# EAGLE design stknx_breakout (EAGLE 9.6.0)
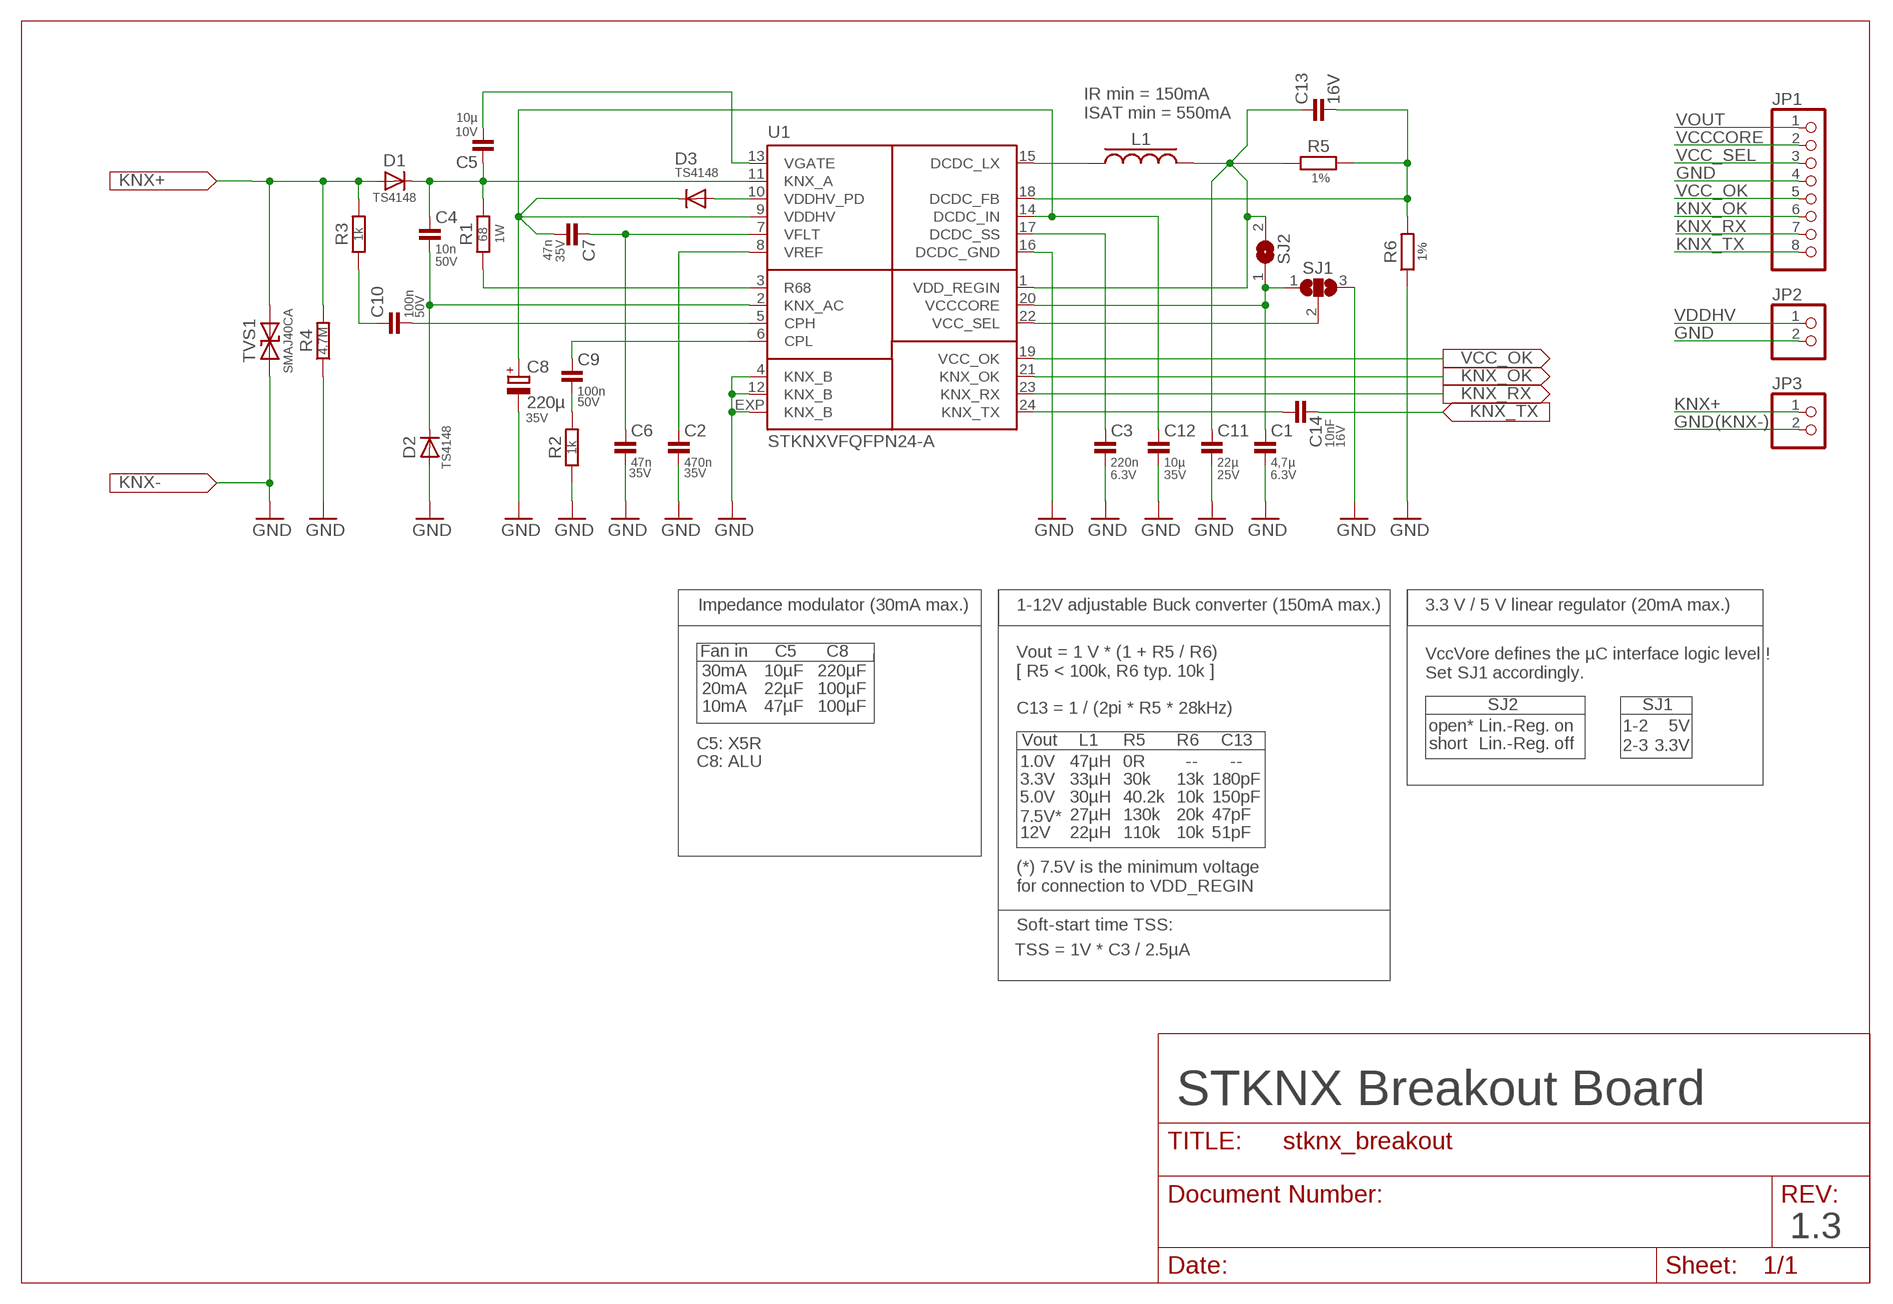
[diagram p0: schematic, sheet 1]

## Parts
C1  4,7µ  C-EUC0805  [C0805]
C2  470n  C-EUC0805  [C0805]
C3  220n  C-EUC0805  [C0805]
C4  10n  C-EUC0805  [C0805]
C5  10µ  C-EUC0805  [C0805]
C6  47n  C-EUC0805  [C0805]
C7  47n  C-EUC0805  [C0805]
C8  220µ  CPOL-EUF  [PANASONIC_F]
C9  100n  C-EUC0805  [C0805]
C10  100n  C-EUC0805  [C0805]
C11  22µ  C-EUC0805  [C0805]
C12  10µ  C-EUC0805  [C0805]
C13  C13  C-EUC0805  [C0805]
C14  10nF  C-EUC0805  [C0805]
D1  TS4148  [0805]
D2  TS4148  [0805]
D3  TS4148  [0805]
JP1  PINHD-1X8  [1X08]
JP2  PINHD-1X2  [1X02]
JP3  PINHD-1X2  [1X02]
L1  L1  WE-LQS_4025_74404043220A  [WE-LQS_4025]
R1  68  R-EU_R1218  [R1218]
R2  1k  R-EU_R0805  [R0805]
R3  1k  R-EU_R0805  [R0805]
R4  4.7M  R-EU_R0805  [R0805]
R5  R5  R-EU_R0805  [R0805]
R6  R6  R-EU_R0805  [R0805]
SJ1  SJ2WW  [SJ_2W]
SJ2  SJW  [SJW]
TVS1  SMAJ40CA  [DO-214AC(SMA)]
U1  STKNXVFQFPN24-A  [VFQFPN24-A]

## Nets
DCDC_FB: C13.2 R5.2 R6.2 U1.18(DCDC_FB)
DCDC_SS: C3.1 U1.17(DCDC_SS)
GND: C1.2 C2.2 C3.2 C6.2 C8.- C11.2 C12.2 D2.A JP1.4 JP2.2 JP3.2 R2.1 R4.1 R6.1 SJ1.3 TVS1.2(A2) U1.4(KNX_B) U1.12(KNX_B) U1.16(DCDC_GND) U1.EXP(KNX_B)
KNX+: D1.A JP3.1 R3.2 R4.2 TVS1.1(A1)
KNX_OK: JP1.6 U1.21(KNX_OK)
KNX_RX: JP1.7 U1.23(KNX_RX)
KNX_TX: C14.2 JP1.8
KNX_TX_1: C14.1 U1.24(KNX_TX)
N$1: C2.1 U1.8(VREF)
N$3: C6.1 C7.1 U1.7(VFLT)
N$4: R1.1 U1.3(R68)
N$6: C4.2 D2.C U1.2(KNX_AC)
N$7: C4.1 C5.1 D1.C R1.2 U1.11(KNX_A)
N$9: D3.A U1.10(VDDHV_PD)
N$10: C9.2 R2.2
N$11: C9.1 U1.6(CPL)
N$12: C10.1 R3.1
N$14: C10.2 U1.5(CPH)
N$15: L1.1 U1.15(DCDC_LX)
VCC_OK: JP1.5 U1.19(VCC_OK)
VCC_SEL: JP1.3 SJ1.2 U1.22(VCC_SEL)
VCCCORE: C1.1 JP1.2 SJ1.1 SJ2.1 U1.20(VCCCORE)
VDDHV: C7.2 C8.+ C12.1 D3.C JP2.1 U1.9(VDDHV) U1.14(DCDC_IN)
VGATE: C5.2 U1.13(VGATE)
VOUT: C11.1 C13.1 JP1.1 L1.2 R5.1 SJ2.2 U1.1(VDD_REGIN)

## Notes on the sheet
- IR min = 150mA
  ISAT min = 550mA
- 1W
- (KNX-)
- Impedance modulator (30mA max.) | 1-12V adjustable Buck converter (150mA max.) | 3.3 V / 5 V linear regulator (20mA max.)
- Fan in | C5 | C8
- 30mA | 10µF | 220µF
- VccVore defines the µC interface logic level !
  Set SJ1 accordingly.
- 20mA | 22µF | 100µF
- 10mA | 47µF | 100µF | SJ2 | SJ1
- Vout = 1 V * (1 + R5 / R6)
  [ R5 < 100k, R6 typ. 10k ]
  
  C13 = 1 / (2pi * R5 * 28kHz)
- open* | Lin.-Reg. on | 1-2 | 5V
- C5: X5R | Vout | L1 | R5 | R6 | C13 | short | Lin.-Reg. off
- 2-3 | 3.3V
- C8: ALU | 1.0V | 47µH | 0R | -- | --
- 3.3V | 33µH | 30k | 13k | 180pF
- 5.0V | 30µH | 40.2k | 10k | 150pF
- 7.5V* | 27µH | 130k | 20k | 47pF
- 12V | 22µH | 110k | 10k | 51pF
- (*) 7.5V is the minimum voltage
  for connection to VDD_REGIN
- Soft-start time TSS:
- TSS = 1V * C3 / 2.5µA
- STKNX Breakout Board
- 1.3

## Library data of the parts
C1 = MyRCL:C-EU: CAPACITOR, European symbol; DIELECTRIC: X5R; SPICEPREFIX: C; TYPE: MLCC; VOLTAGE: 6.3V
C2 C6 C7 C12 = MyRCL:C-EU: CAPACITOR, European symbol; SPICEPREFIX: C; TYPE: MLCC; VOLTAGE: 35V
C3 = MyRCL:C-EU: CAPACITOR, European symbol; SPICEPREFIX: C; TYPE: MLCC; VOLTAGE: 6.3V
C4 C9 C10 = MyRCL:C-EU: CAPACITOR, European symbol; SPICEPREFIX: C; TYPE: MLCC; VOLTAGE: 50V
C5 = MyRCL:C-EU: CAPACITOR, European symbol; DIELECTRIC: X5R; SPICEPREFIX: C; TYPE: MLCC; VOLTAGE: 10V
C8 = resistor:CPOL-EU: POLARIZED CAPACITOR, European symbol; PANASONIC: EEEFT1H221AP; REICHELT: FT-V 220U 50; TYPE: ELYT; VOLTAGE: 35V
C11 = MyRCL:C-EU: CAPACITOR, European symbol; DIELECTRIC: X5R; SPICEPREFIX: C; TYPE: MLCC; VOLTAGE: 25V
C13 C14 = MyRCL:C-EU: CAPACITOR, European symbol; SPICEPREFIX: C; TYPE: MLCC; VOLTAGE: 16V
D1-D3 = MyDiode:TS4148: Small Signal Fast Switching Diodes
JP1 = pinhead:PINHD-1X8: PIN HEADER
JP2 JP3 = pinhead:PINHD-1X2: PIN HEADER
L1 = MyPowerMagnetics:WE-LQS_4025: SMD Shielded Tiny Power Inductor Characteristics Tiny Power Inductor design 1.7 times more current in comparison with unshielded versions Robust design & high durability Low RDC Magnetically shielded with magnetic glue reducing buzz noise in ultra-low levels Operating Temperature: –40 °C to +125 °C Applications Integrated DC/DC Converters Switching controllers which required high efficiency Portable power (Smartphones, digital cameras, Tablets, etc.) Embedded laptops and PCs Big sizes (5040, 60xx, 8040) used for shock-proof circuits <http://katalog.we-online.de/media/images/v2/Family_WE-LQS.jpg> Details see: http://katalog.we-online.de/en/pbs/WE-LQS Created by Dan Xu 2014-05-21 2014 (C) Wurth Elektronik; WE-NUMBER: 74404043220A/22uH
R1-R4 = MyRCL:R-EU_: RESISTOR, European symbol
R5 R6 = MyRCL:R-EU_: RESISTOR, European symbol; TOLERANCE: 1%
SJ1 = MyJumper:SJ2W: SMD solder JUMPER
SJ2 = MyJumper:SJ: SMD solder JUMPER
TVS1 = MyDiode:SMAJ*CA: Transient Voltage Suppressor Diode https://www.vishay.com/docs/88390/smaj50a.pdf; MARKING: YR; WURTH_ELEKTRONICS: 824501401
U1 = stknx:STKNX: STKNX Miniature KNX transceiver with voltage regulators see: http://www.st.com/content/st_com/en/products/interfaces-and-transceivers/power-line-transceivers/stknx.html

## Board
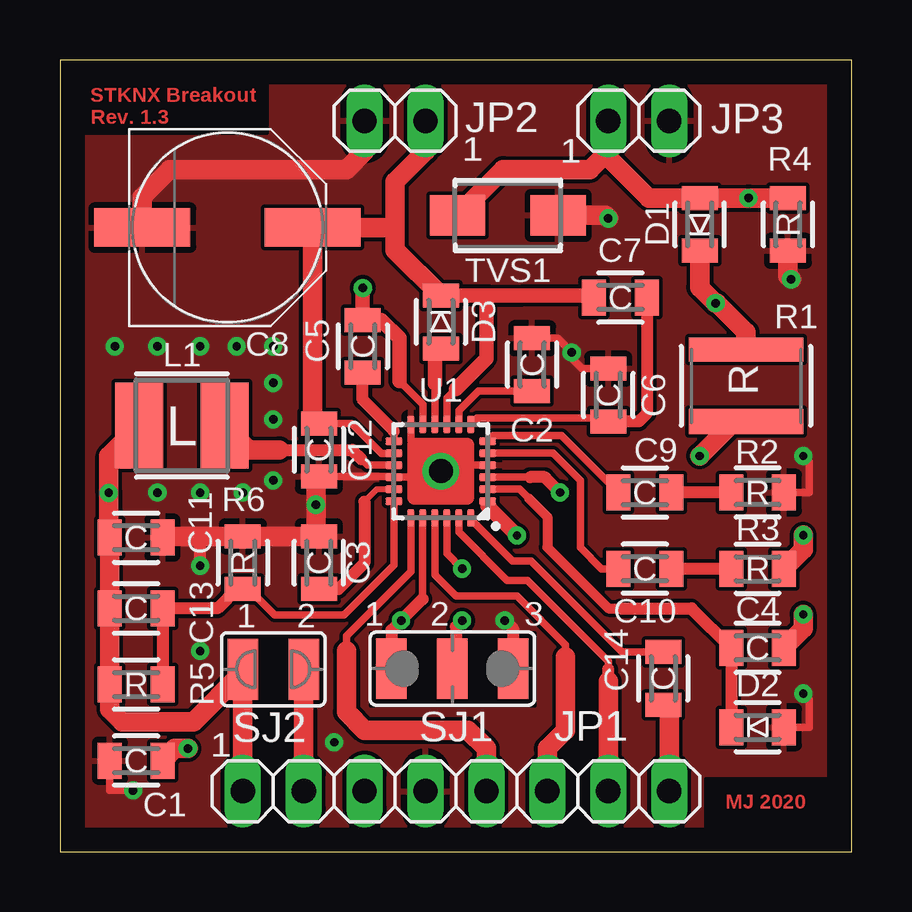
[diagram p1: board, top side]
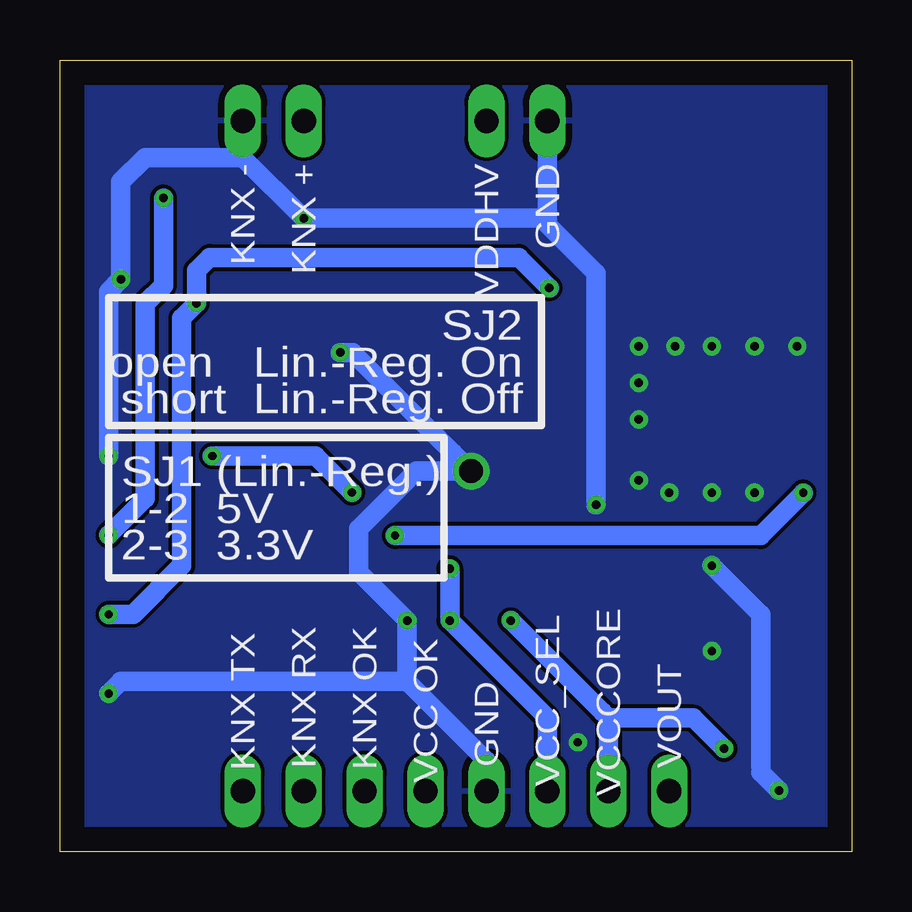
[diagram p2: board, bottom side, seen from below]

Size 33.02 x 33.02 mm. Coordinates in mm from the lower left corner, seen from the top.
Outline: 33.02,33.02 0,33.02 0,0 33.02,0 33.02,33.02
Copper layers (1*16): Top 0.035mm / dielectric 1.5mm / Bottom 0.035mm
Design rules "default *": minimum track width 6mil, minimum drill 0.35mm, track to track 6mil, track to pad 6mil, pad to pad 6mil, via to via 6mil, smd to smd 6mil, copper to edge 40mil, drill to drill 6mil, minimum pad ring 10mil, minimum via ring 8mil, stop-mask expansion 4mil, vias tented up to drill 0mil, thermal gap 10mil

### Footprints (pad centres in the part's own frame; a part is rotated, then mirrored left to right if it is on the bottom)
C0805 = smd 1 x 1.5: 1 -1.1,0; 2 1.1,0
PANASONIC_F = smd 4 x 1.6: + 3.55,0; - -3.55,0
0805 = smd 1 x 1.5: A 1.1,0; C -1.1,0
1X08 = drill 1.016 long: 1 -8.89,0; 2 -6.35,0; 3 -3.81,0; 4 -1.27,0; 5 1.27,0; 6 3.81,0; 7 6.35,0; 8 8.89,0
1X02 = drill 1.016 long: 1 -1.27,0; 2 1.27,0
WE-LQS_4025 = smd 2 x 3.6: 1 -1.775,0; 2 1.775,0
R1218 = smd 1.05 x 4.77: 1 -1.485,0 | smd 1 x 4.77: 2 1.51,0
R0805 = smd 1 x 1.5: 1 -1.1,0; 2 1.1,0
SJ_2W = smd 1.27 x 2.54: 1 -2.54,0; 2 0,0; 3 2.54,0
SJW = smd 1.27 x 2.54: 1 -1.27,0; 2 1.27,0
DO-214AC(SMA) = smd 2.3 x 1.7: 1 -2.1,0; 2 2.1,0
VFQFPN24-A = smd 0.7 x 0.3: 1 -1.95,1.25; 2 -1.95,0.75; 3 -1.95,0.25; 4 -1.95,-0.25; 5 -1.95,-0.75; 6 -1.95,-1.25; 13 1.95,-1.25; 14 1.95,-0.75; 15 1.95,-0.25; 16 1.95,0.25; 17 1.95,0.75; 18 1.95,1.25 | smd 0.3 x 0.7: 7 -1.25,-1.95; 8 -0.75,-1.95; 9 -0.25,-1.95; 10 0.25,-1.95; 11 0.75,-1.95; 12 1.25,-1.95; 19 1.25,1.95; 20 0.75,1.95; 21 0.25,1.95; 22 -0.25,1.95; 23 -0.75,1.95; 24 -1.25,1.95 | drill 1: EXP 0,0

### Placement (x,y rotation side)
C1  3.17,3.81 180 top
C2  19.68,20.32 90 top
C3  10.79,12.06 90 top
C4  29.08,8.51 180 top
C5  12.62,21.09 270 top
C6  22.86,19.05 90 top
C7  23.37,23.11 180 top
C8  6.99,26.04 0 top
C9  24.38,14.99 0 top
C10  24.38,11.81 180 top
C11  3.17,13.11 0 top
C12  10.79,16.76 270 top
C13  3.17,10.16 0 top
C14  25.15,7.24 270 top
D1  26.67,26.16 90 top
D2  29.08,5.21 0 top
D3  15.88,22.1 270 top
JP1  16.51,2.54 0 top
JP2  13.97,30.48 180 top
JP3  24.13,30.48 0 top
L1  5.08,17.78 180 top
R1  28.6,19.43 90 top
R2  29.08,14.99 180 top
R3  29.08,11.81 0 top
R4  30.35,26.16 90 top
R5  3.17,6.99 0 top
R6  7.62,12.06 270 top
SJ1  16.36,7.65 0 top
SJ2  8.89,7.62 180 top
TVS1  18.67,26.54 0 top
U1  15.88,15.88 180 top

### Tracks (layer width: path | path; a pad name or v marks a point on that pad's centre or on a via)
DCDC_FB
  Top 0.152: 7.37,10.96 R6.2 7.87,10.96 | 5.71,10.16 4.45,10.16 C13.2
  Top 0.305: U1.18 13.93,11.96 11.84,9.88 8.95,9.88 7.87,10.96
  Top 0.508: C13.2 R5.2 | 7.37,10.96 6.57,10.16 5.71,10.16 4.45,10.16
DCDC_SS
  Top 0.254: 12.69,14.61 13.21,15.12 U1.17
  Top 0.508: C3.1 11.61,10.96 12.69,12.05 12.69,14.61
GND  (via drill 0.35)
  Top 0.152: 4.33,13.16 C11.2 | 13.91,15.64 U1.16 | U1.EXP 14.62,17.12 | 16.12,16.12 U1.EXP | U1.EXP 15.62,15.62
  Top 0.254: 13.89,15.66 13.91,15.64
  Top 0.305: 14.62,17.12 U1.12 | U1.4 16.12,16.12 | 15.62,15.62 U1.16 | 13.89,15.66 C12.2 10.67,15.54 | C2.2 20.74,21.42 v21.34,20.83 21.34,20.57 21.76,20.15 C6.2 | R2.1 31.24,14.99 31.24,16.26 v30.99,16.51 | D2.A 31.24,5.21 31.24,6.35 v30.99,6.6 | C1.2 2.08,2.56 v3.05,2.56
  Top 0.508: SJ1.3 18.9,9.3 v18.54,9.65 | v5.84,11.94 5.84,13.16
  Top 0.813: 4.33,13.16 5.59,13.16 5.84,13.16 6.35,13.16 R6.1 C3.2 10.67,13.29 v10.67,14.48 10.67,15.54 | TVS1.2 22.73,26.54 v22.86,26.42 | v30.48,23.88 30.35,24 R4.1 | C8.- 3.44,27.3 4.58,28.45 11.94,28.45 12.7,29.21 JP2.2
  Bottom 0.305: 3.81,3.56 3.81,3.33
  Bottom 0.813: 12.83,26.29 12.95,26.42 v22.86,26.42 25.4,28.96 | 12.83,26.29 10.67,24.13 v10.67,14.48 | v21.34,20.83 20.83,20.83 16.64,16.64 U1.EXP 18.16,15.88 20.57,13.46 20.57,11.68 v18.54,9.65 18.54,7.11 | 3.81,3.56 3.81,9.91 v5.84,11.94 | v30.99,16.51 30.99,23.37 v30.48,23.88 30.48,27.94 29.46,28.96 25.4,28.96 | v30.99,6.6 30.48,7.11 18.54,7.11 | 18.54,7.11 15.24,3.81 JP1.4 | 12.83,26.29 12.7,26.42 JP2.2 | JP3.2 25.4,28.96 | 3.81,3.33 v3.05,2.56
  other vias: 2.29,21.08 4.06,21.08 5.84,21.08 7.37,21.08 8.89,21.08 8.89,19.56 8.89,18.03 8.89,15.49 7.62,14.99 5.84,14.99 4.06,14.99 5.84,8.38 11.43,4.57
  pour Bottom: 0.64,32.38 32.38,32.38 32.38,0.64 0.64,0.64
  pour Top: 0.64,32.38 32.38,32.38 32.38,0.64 0.64,0.64
KNX+  (via drill 0.35)
  Top 0.813: R4.2 v28.7,27.26 D1.A 24.55,27.26 22.86,28.96 JP3.1 22.86,29.21 22.1,28.45 18.47,28.45 TVS1.1 | R3.2 30.99,12.62 v30.99,13.21
  Bottom 0.813: v30.99,13.21 29.46,14.73 29.46,22.86 28.7,23.62 v28.7,27.26
KNX_OK
  Top 0.305: U1.21 15.62,11.55 16.51,10.67 19.05,10.67 21.08,8.64 21.08,8.13
  Top 0.813: 21.08,8.13 21.08,5.08 20.32,4.32 JP1.6
KNX_RX
  Top 0.305: 22.86,7.62 22.86,7.95 19.48,11.33 18.64,11.33 16.62,13.35 U1.23
  Top 0.508: 22.86,7.11 22.86,7.62
  Top 0.813: JP1.7 22.86,7.11
KNX_TX
  Top 0.305: 25.4,5.88 C14.2
  Top 0.813: JP1.8 25.4,5.88
KNX_TX_1
  Top 0.305: U1.24 17.14,13.9 17.14,13.87 18.87,12.14 19.63,12.14 23.44,8.34 C14.1
N$1
  Top 0.305: U1.8 16.62,18.4 17.44,19.22 C2.1
N$2
  cutout Top: 6.86,9.14 6.86,6.1 10.92,6.1 10.92,9.14
N$3
  Top 0.254: C6.1 22.73,18.09
  Top 0.305: U1.7 17.39,18.09 18.29,18.09 22.73,18.09
  Top 0.508: C7.1 24.47,18.29 24.13,17.95 C6.1
N$4  (via drill 0.35)
  Top 0.305: 19.6,15.62 U1.3
  Top 0.508: 19.6,15.62 20.21,15.62 20.34,15.5 v20.85,14.99
  Top 0.813: v26.67,16.51 28.11,17.95 R1.1
  Bottom 0.813: v20.85,14.99 22.37,16.51 v26.67,16.51
N$5
  cutout Top: 12.95,9.14 12.95,6.1 19.81,6.1 19.81,9.14
N$6
  Top 0.305: U1.2 19.16,15.12 19.56,14.73
  Top 0.406: 23.37,10.16 22.86,10.16 20.32,12.7 20.32,13.97 19.56,14.73
  Top 0.508: D2.C C4.2 26.33,10.16 23.37,10.16
N$7  (via drill 0.35)
  Top 0.305: U1.11 15.12,18.66 14.15,19.64
  Top 0.61: 14.15,19.64 14.15,21.42 13.39,22.18 C5.1 v12.62,23.52
  Top 0.813: D1.C 26.67,23.54 v27.33,22.88 27.39,22.88 28.6,21.67 R1.2 | v30.99,9.91 30.99,9.31 C4.1
  Bottom 0.813: v12.62,23.52 13.89,24.79 26.78,24.79 27.33,24.23 v27.33,22.88 27.94,22.27 27.94,11.94 29.97,9.91 v30.99,9.91
N$8
  cutout Top: 13.97,17.78 17.78,17.78 17.78,13.97 13.97,13.97
N$9
  Top 0.305: U1.10 15.62,19.54
  Top 0.508: 15.62,20.75 D3.A
  Top 0.61: 15.62,19.54 15.62,20.75
N$10
  Top 0.508: R2.2 C9.2
N$11
  Top 0.305: U1.6 18.05,17.35 20.92,17.35 C9.1
N$12
  Top 0.508: R3.1 C10.1
N$13
  cutout Top: 1.02,32 8.64,32 8.64,29.97 1.02,29.97
N$14
  Top 0.305: U1.5 20.55,16.62 21.69,15.49 21.69,12.7 22.58,11.81 C10.2
N$15
  Top 0.305: 12.57,16.38 12.82,16.12 U1.15
  Top 0.508: 9.14,16.76 12.18,16.76 12.57,16.38
  Top 0.813: L1.1 7.87,16.76 9.14,16.76
N$16
  cutout Top: 32,1.02 32,3.05 26.92,3.05 26.92,1.02
VCC_OK
  Top 0.305: U1.19 14.62,11.7 11.94,9.02 11.94,8.38
  Top 0.813: 11.94,8.38 11.94,5.84 12.7,5.08 17.02,5.08 17.78,4.32 JP1.5
VCC_SEL  (via drill 0.35)
  Top 0.305: U1.22 16.12,12.45 v16.76,11.81 | 16.51,7.8 SJ1.2
  Top 0.508: v16.76,9.65 16.51,9.4 16.51,7.8
  Bottom 0.813: v16.76,11.81 v16.76,9.65 12.7,5.59 JP1.3
VCCCORE  (via drill 0.35)
  Top 0.152: U1.20 15.12,13.92
  Top 0.305: 15.12,13.92 15.12,10.54
  Top 0.508: 15.12,10.54 v14.22,9.65 13.82,9.25 SJ1.1
  Top 0.813: C1.1 4.78,4.32 v5.33,4.32 | SJ2.1 JP1.2
  Bottom 0.813: v14.22,9.65 10.41,5.84 10.16,5.59 | v5.33,4.32 6.6,5.59 10.16,5.59 | 10.16,5.59 JP1.2
VDDHV
  Top 0.152: 13.63,16.62 U1.14 | 10.54,18.12 C12.1
  Top 0.305: C12.1 12.16,17.86 13.4,16.62 13.63,16.62 | U1.9 16.12,18.92 16.26,19.05 16.51,19.3
  Top 0.61: 19.3,23.2 17.86,23.2 D3.C | C7.2 22.01,23.11 21.93,23.2 19.3,23.2 | 19.3,23.2 17.78,23.2 17.78,20.57 16.51,19.3
  Top 0.813: 13.97,26.04 13.97,25.1 D3.C | C12.1 10.54,18.12 C8.+ 13.97,26.04 | JP2.1 15.24,29.21 13.97,27.94 13.97,26.04
VGATE
  Top 0.305: 13.93,17.55 U1.13 | 12.7,18.77 12.62,18.85
  Top 0.508: 13.93,17.55 12.7,18.77 | 12.62,18.85 C5.2
VOUT  (via drill 0.35)
  Top 0.254: 17.82,14.42 U1.1
  Top 0.305: SJ2.2 7.62,7.49
  Top 0.61: v19.05,13.2 17.82,14.42
  Top 0.813: 7.62,7.49 5.56,5.44 2.59,5.44 2.08,5.95 R5.1 C13.1 C11.1 2.03,13.15 v2.03,14.97 2.03,16.51 L1.2 | SJ2.2 JP1.1
  Bottom 0.813: v19.05,13.2 3.81,13.2 v2.03,14.97

### Text on the board
Top: STKNX Breakout / Rev. 1.3 | MJ 2020
tPlace: 1 | 1 | 1 | 2 | 1 | 2 | 3 | 1
bPlace: GND | VDDHV | KNX + | KNX - | SJ2 / open Lin.-Reg. On / short Lin.-Reg. Off | SJ1 (Lin.-Reg.) / 1-2 5V / 2-3 3.3V | VCCCORE | VCC_SEL | VCC OK | KNX OK | KNX RX | KNX TX | VOUT | GND